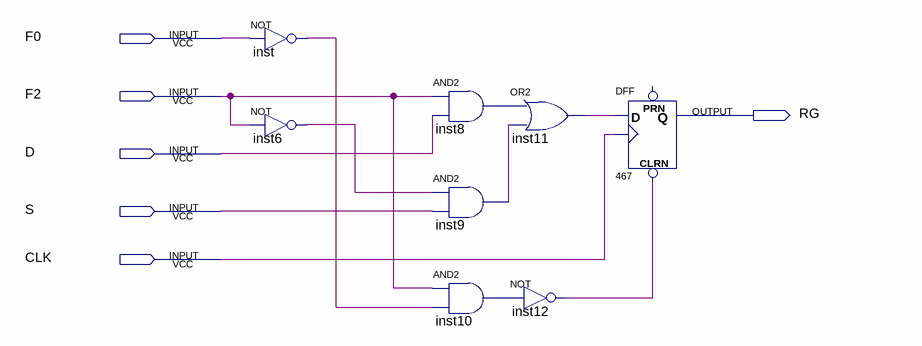
[diagram p0: schematic sheet]
// Quartus schematic RG.bdf as structural Verilog: 8 symbols, 6 pins
module RG (
  input  F0,
  input  F2,
  input  D,
  input  S,
  input  CLK,
  output RG
);

  wire inst6_out, inst8_out, inst9_out, inst10_out, inst11_out, inst12_out, inst_out;

  not inst (inst_out, F0);
  not inst6 (inst6_out, F2);
  and inst8 (inst8_out, F2, D);
  and inst9 (inst9_out, inst6_out, S);
  and inst10 (inst10_out, F2, inst_out);
  or inst11 (inst11_out, inst8_out, inst9_out);
  not inst12 (inst12_out, inst10_out);
  DFF u_467 (.CLRN(inst12_out), .CLK(CLK), .D(inst11_out), .Q(RG));  // open: PRN
endmodule
